# Altium schematic sheet 电源.SchDoc: 电源
size A4; Organization: Altium Limited; Address1: L3, 12a Rodborough Rd; Address2: Frenchs Forest; Address3: NSW; Address4: Australia 2086; DocumentNumber: 2; Revision: V1.0; SheetNumber: 2; SheetTotal: 6; Designer: 樊浩柏
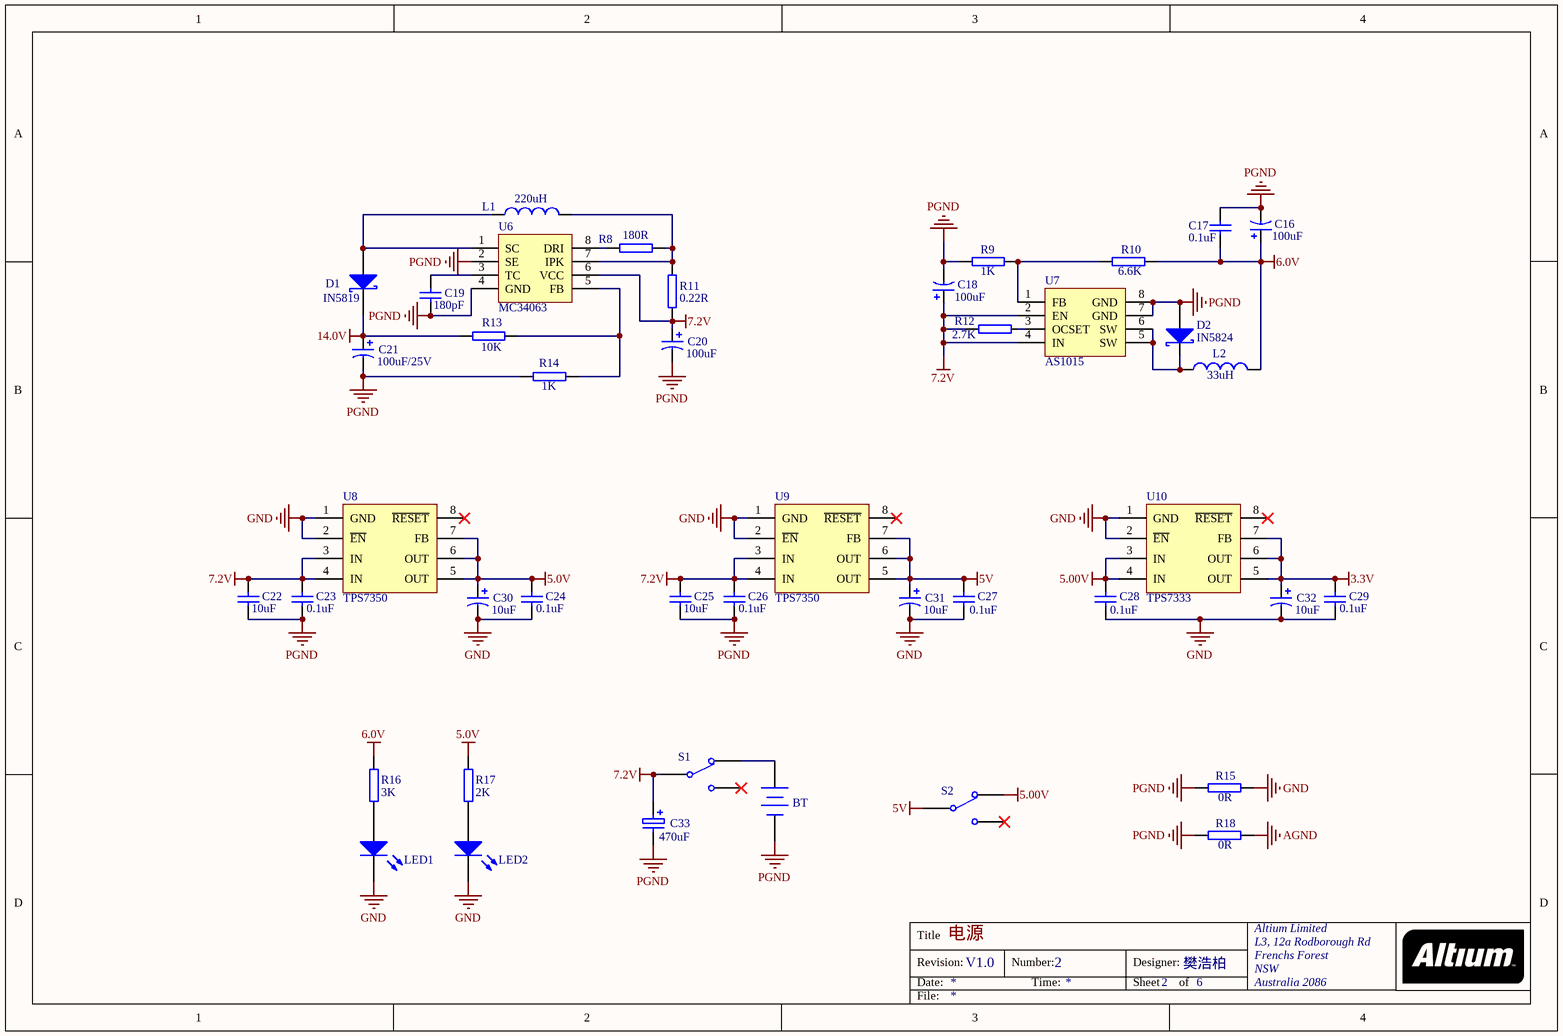
[diagram p0: 电源.SchDoc]

## Parts
BT  Battery  [Header-5.0-SMD]  (value not drawn)
C16  100uF  [CASE-C_6032-28]
C17  0.1uF  [CAP-0603]
C18  100uF  [CASE-C_6032-28]
C19  180pF  [CAP-0603]
C20  100uF  [CASE-C_6032-28]
C21  100uF/25V  [CASE-D_7343-31]
C22  10uF  [CAP-0603]
C23  0.1uF  [CAP-0603]
C24  0.1uF  [CAP-0603]
C25  10uF  [CAP-0603]
C26  0.1uF  [CAP-0603]
C27  0.1uF  [CAP-0603]
C28  0.1uF  [CAP-0603]
C29  0.1uF  [CAP-0603]
C30  10uF  [CASE-A_3216-18]
C31  10uF  [CASE-A_3216-18]
C32  10uF  [CASE-A_3216-18]
C33  470uF  [CAP-ALU-F_8.0x8.3x10.2]
D1  IN5819  [Diode-SMD-SOD-123]
D2  IN5824  [Diode-SMD-SMA]
L1  220uH  [Inductor-CD-54]
L2  33uH  [Inductor-CD-54]
LED1  LED  [LED-GRE-0603]  (value not drawn)
LED2  LED  [LED-BLU-0603]  (value not drawn)
R8  180R  [RES-0603]
R9  1K  [RES-0603]
R10  6.6K  [RES-0603]
R11  0.22R  [RES-0603]
R12  2.7K  [RES-0603]
R13  10K  [RES-0603]
R14  1K  [RES-0603]
R15  0R  [RES-0603]
R16  3K  [RES-0603]
R17  2K  [RES-0603]
R18  0R  [RES-0603]
S1  Key-3  [SW-3-SMTS-102]  (value not drawn)
S2  Key-3  [SW-3-SMTS-102]  (value not drawn)
U6  MC34063  [SOP-8]
U7  AS1015  [SOP-8]
U8  TPS7350  [SOP-8]
U9  TPS7350  [SOP-8]
U10  TPS7333  [SOP-8]

## Nets
3.3V: C29.2 C32.A U10.5(OUT) U10.6(OUT) U10.7(FB)
5.00V: C28.2 S2.3 U10.3(IN) U10.4(IN)
5.0V: C24.2 C30.A R17.2 U8.5(OUT) U8.6(OUT) U8.7(FB)
5V: C27.2 C31.A S2.2 U9.5(OUT) U9.6(OUT) U9.7(FB)
6.0V: C16.A C17.1 L2.2 R10.1 R16.2
7.2V: C18.A C20.A C22.2 C23.2 C25.2 C26.2 C33.A R11.1 R12.2 S1.2 U6.6(VCC) U7.2(EN) U7.4(IN) U8.3(IN) U8.4(IN) U9.3(IN) U9.4(IN)
14.0V: C21.A D1.K R13.1
AGND: R18.1
GND: C24.1 C27.1 C28.1 C29.1 C30.K C31.K C32.K LED1.K LED2.K R15.1 U8.1(GND) U8.2(~{EN}) U9.1(GND) U9.2(~{EN}) U10.1(GND) U10.2(~{EN})
PGND: BT.2(-) C16.K C17.2 C18.K C19.1 C20.K C21.K C22.1 C23.1 C25.1 C26.1 C33.K D2.A R9.1 R14.2 R15.2 R18.2 U6.2(SE) U6.4(GND) U7.7(GND) U7.8(GND)
NetBT_1: BT.1(+) S1.3
NetC19_2: C19.2 U6.3(TC)
NetD1_A: D1.A L1.1 U6.1(SC)
NetD2_K: D2.K L2.1 U7.5(SW) U7.6(SW)
NetL1_2: L1.2 R8.2 R11.2 U6.7(IPK)
NetLED1_A: LED1.A R16.1
NetLED2_A: LED2.A R17.1
NetR8_1: R8.1 U6.8(DRI)
NetR9_2: R9.2 R10.2 U7.1(FB)
NetR12_1: R12.1 U7.3(OCSET)
NetR13_2: R13.2 R14.1 U6.5(FB)

Not connected (* = marked no-connect by the designer): S1 1*; S2 1*; U8 8(~{RESET})*; U9 8(~{RESET})*; U10 8(~{RESET})*

## Notes on the sheet
- Title
- Revision:
- Date:
- Number:
- Time:
- Designer:
- Sheet
- of
- File:

## Library data of the parts
C16 C18 C20 C21 C30-C32 = Cap-Pol_1
C17 C19 C22-C29 = Cap
C33 = Cap-Pol_2
D1 D2 = Diode-Schottky
L1 L2 = Inductor
R8-R18 = Res
U10 = TPS7350